# EAGLE design trezor_v1 (EAGLE 6.5.0)
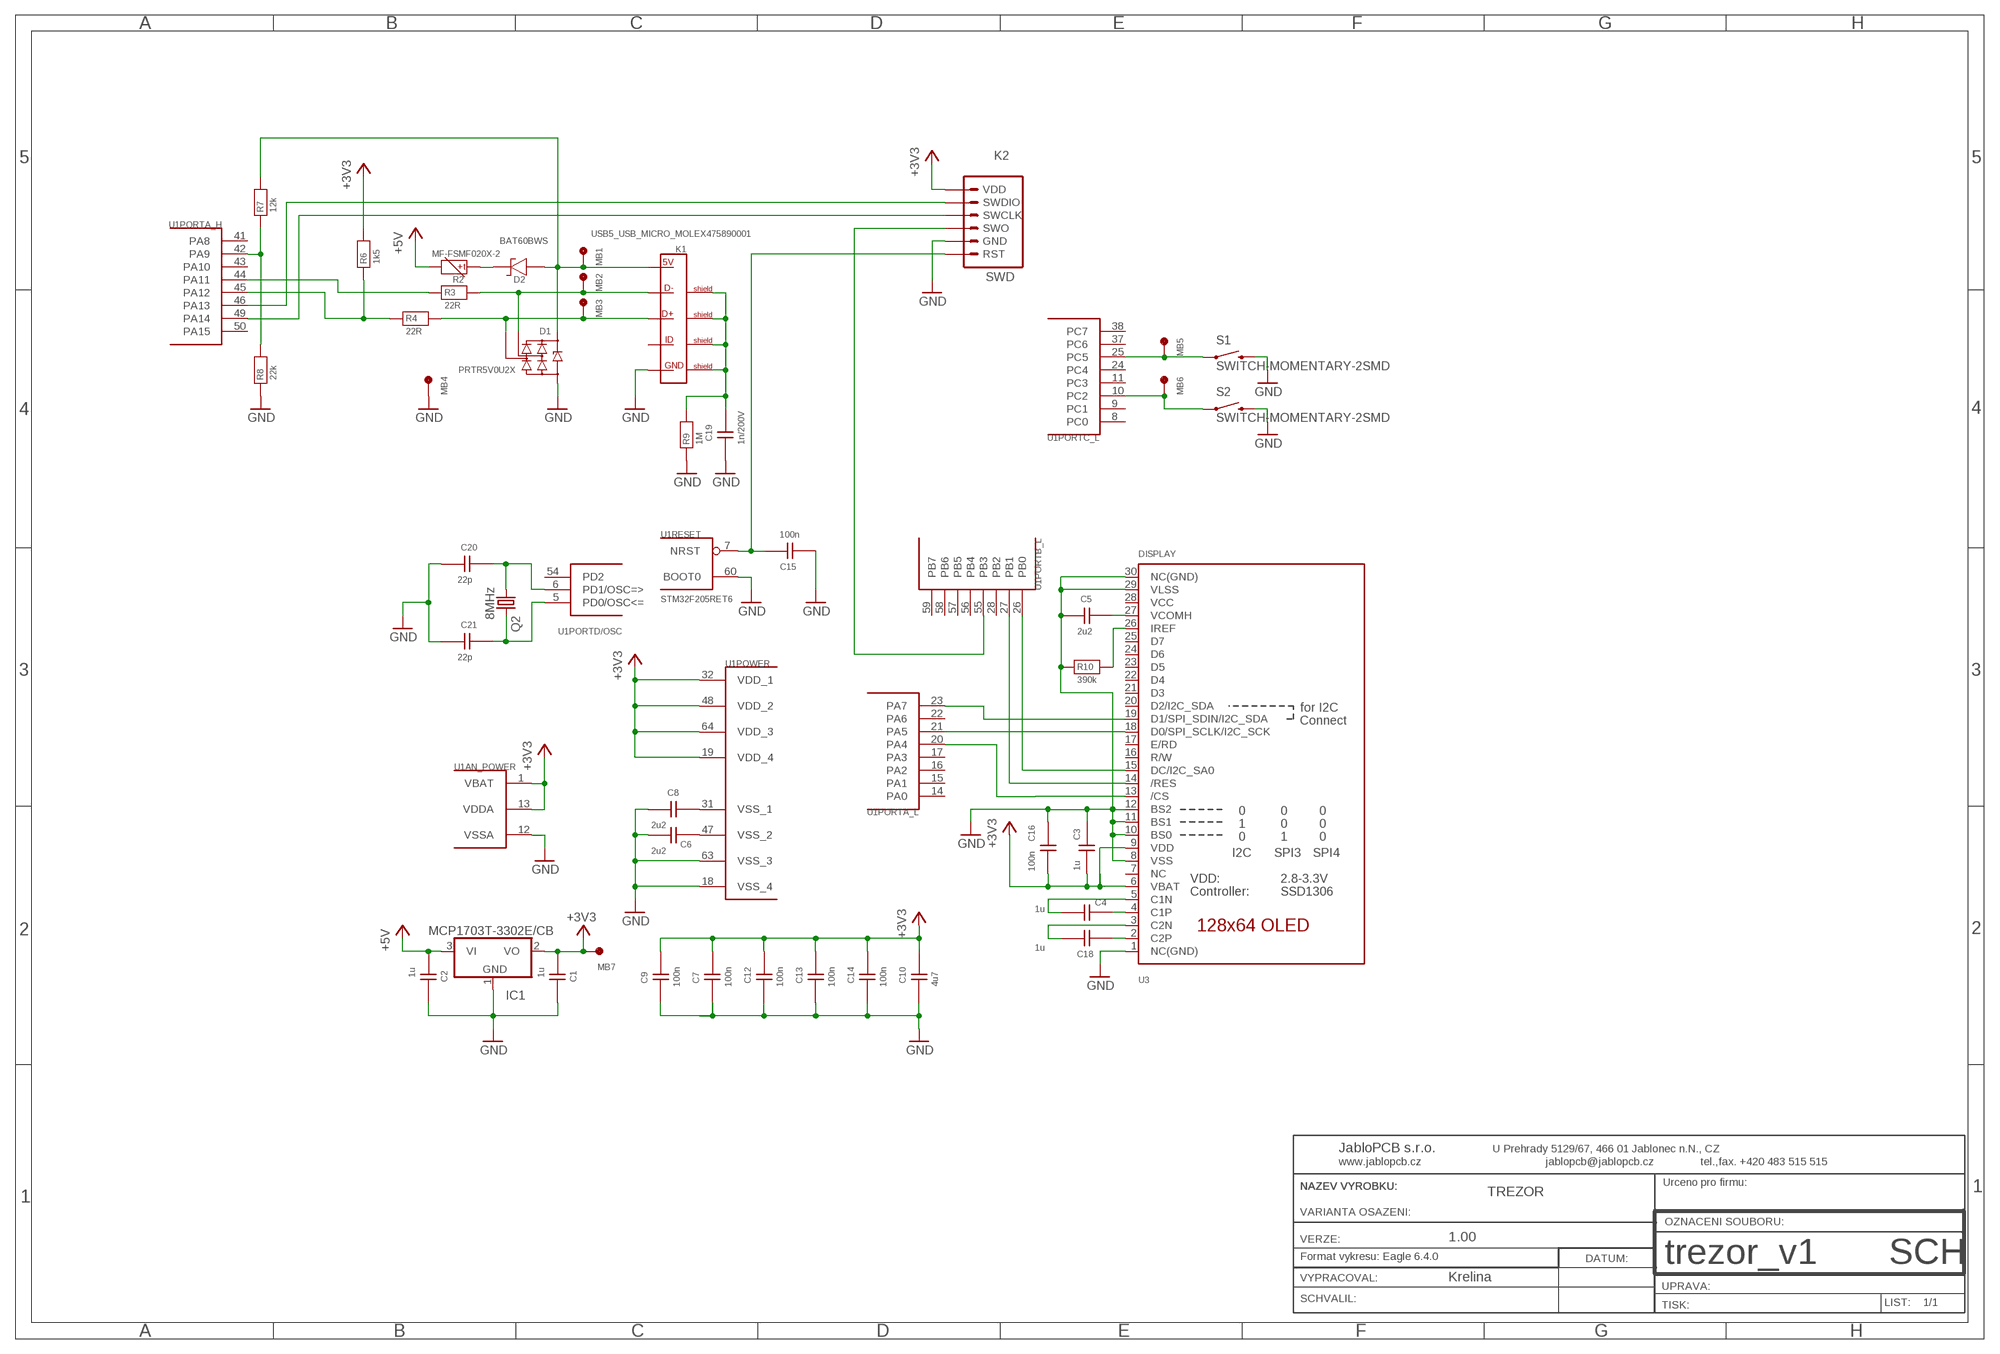
[diagram p0: schematic, sheet 1]

## Parts
C1  1u  C_0402  [0402]
C2  1u  C_0402  [0402]
C3  1u  C_0402  [0402]
C4  1u  C_0402  [0402]
C5  2u2  C_0603  [0603]
C6  2u2  C_0402  [0402]
C7  100n  C_0402  [0402]
C8  2u2  C_0402  [0402]
C9  100n  C_0402  [0402]
C10  4u7  C_0603  [0603]
C12  100n  C_0402  [0402]
C13  100n  C_0402  [0402]
C14  100n  C_0402  [0402]
C15  100n  C_0402  [0402]
C16  100n  C_0402  [0402]
C18  1u  C_0402  [0402]
C19  1n/200V  C_0603  [0603]
C20  22p  C_0402  [0402]
C21  22p  C_0402  [0402]
D1  PRTR5V0U2X  PRTR5V0_SOT143B  [SOT143B]
D2  BAT60BWS  DS_SOD323  [SOD323]
IC1  MCP1703T-3302E/CB  MCP1703CB  [SOT23]
K1  USB5_USB_MICRO_MOLEX475890001  [USB_MICRO-MOLEX475890001]
K2  SWD  [SWD]
MB1  MB_1.50  [MB1.5]
MB2  MB_1.50  [MB1.5]
MB3  MB_1.50  [MB1.5]
MB4  MB_1.50  [MB1.5]
MB5  MB_1.50  [MB1.5]
MB6  MB_1.50  [MB1.5]
MB7  MB_1.50  [MB1.5]
Q2  8MHz  CRYSTALCTS406  [CTS406]
R2  MF-FSMF020X-2  POLYSWITCH_0603  [0603]
R3  22R  R_0402  [0402]
R4  22R  R_0402  [0402]
R6  1k5  R_0402  [0402]
R7  12k  R_0402  [0402]
R8  22k  R_0402  [0402]
R9  1M  R_0603  [0603]
R10  390k  R_0402  [0402]
S1  SWITCH-MOMENTARY-2SMD  [TACTILE_SWITCH_SMD]
S2  SWITCH-MOMENTARY-2SMD  [TACTILE_SWITCH_SMD]
U1  STM32F205RET6  STM32F10XRXT6  [TQFP64]
U3  DISPLAY  DISP_OLED_UG-2864HSWEG010.96"  [UG-2864HSWEG01_0.96IN_WRAPAROUND]

## Nets
+3V3: C1.P$1 C3.P$1 C7.P$2 C9.P$2 C10.2 C12.P$2 C13.P$2 C14.P$2 C16.P$1 IC1.2(VO) K2.6(VDD) MB7.1 R6.P$2 U1.1(AN_POWER:VBAT) U1.13(AN_POWER:VDDA) U1.19(POWER:VDD_4) U1.32(POWER:VDD_1) U1.48(POWER:VDD_2) U1.64(POWER:VDD_3) U3.6(VBAT) U3.9(VDD)
+5V: C2.P$1 IC1.3(VI) R2.2
GND: C1.P$2 C2.P$2 C3.P$2 C5.1 C6.P$1 C7.P$1 C8.P$1 C9.P$1 C10.1 C12.P$1 C13.P$1 C14.P$1 C15.P$1 C16.P$2 C19.1 C20.P$1 C21.P$1 D1.1(GND) IC1.1(GND) K1.5(5_GND) K2.2(GND) MB4.1 R8.P$1 R9.1 R10.P$1 S1.3 S1.4 S2.3 S2.4 U1.12(AN_POWER:VSSA) U1.18(POWER:VSS_4) U1.60(RESET:BOOT0) U1.63(POWER:VSS_3) U3.1(NC(GND)) U3.8(VSS) U3.10(BS0) U3.11(BS1) U3.12(BS2) U3.29(VLSS) U3.30(NC(GND))
N$1: U1.23(PORTA_L:PA7) U3.19(D1/SPI_SDIN/I2C_SDA)
N$2: C15.P$2 K2.1(RST) U1.7(RESET:NRST)
N$3: U1.26(PORTB_L:PB0) U3.15(DC/I2C_SA0)
N$4: C8.P$2 U1.31(POWER:VSS_1)
N$5: U1.21(PORTA_L:PA5) U3.18(D0/SPI_SCLK/I2C_SCK)
N$6: C5.2 U3.27(VCOMH)
N$7: U1.27(PORTB_L:PB1) U3.14(/RES)
N$8: C6.P$2 U1.47(POWER:VSS_2)
N$9: R10.P$2 U3.26(IREF)
N$10: C18.P$1 U3.2(C2P)
N$11: C4.P$1 U3.4(C1P)
N$12: C18.P$2 U3.3(C2N)
N$13: C4.P$2 U3.5(C1N)
N$14: K2.3(SWO) U1.55(PORTB_L:PB3)
N$15: K2.5(SWDIO) U1.46(PORTA_H:PA13)
N$16: U1.20(PORTA_L:PA4) U3.13(/CS)
N$17: K2.4(SWCLK) U1.49(PORTA_H:PA14)
N$18: R3.P$1 U1.44(PORTA_H:PA11)
N$19: MB5.1 S1.1 S1.2 U1.25(PORTC_L:PC5)
N$20: MB6.1 S2.1 S2.2 U1.10(PORTC_L:PC2)
N$21: D1.4(VCC) D2.A K1.1(1_5V) MB1.1 R7.P$2
N$22: D2.K R2.1
N$23: D1.2(I/O1) K1.2(2_D-) MB2.1 R3.P$2
N$24: D1.3(I/O2) K1.3(3_D+) MB3.1 R4.P$2
N$26: C19.2 K1.S1_BOT(SHIELD_1) K1.S1_TOP(SHIELD_1) K1.S2_BOT(SHIELD_2) K1.S2_TOP(SHIELD_2) K1.S3_BOT(SHIELD_3) K1.S3_TOP(SHIELD_3) K1.S4_BOT(SHIELD_4) K1.S4_TOP(SHIELD_4) K1.SA(SHIELD_1) K1.SB(SHIELD_2) R9.2
N$27: R7.P$1 R8.P$2 U1.42(PORTA_H:PA9)
USB_D_P: R4.P$1 R6.P$1 U1.45(PORTA_H:PA12)
XTAL1: C20.P$2 Q2.1 U1.6(PORTD/OSC:PD1/OSC=>)
XTAL2: C21.P$2 Q2.3 U1.5(PORTD/OSC:PD0/OSC<=)
Unconnected: K1.4(4_ID) U1.2(PORTC_H:PC13) U1.3(PORTC_H:PC14) U1.4(PORTC_H:PC15) U1.8(PORTC_L:PC0) U1.9(PORTC_L:PC1) U1.11(PORTC_L:PC3) U1.14(PORTA_L:PA0) U1.15(PORTA_L:PA1) U1.16(PORTA_L:PA2) U1.17(PORTA_L:PA3) U1.22(PORTA_L:PA6) U1.24(PORTC_L:PC4) U1.28(PORTB_L:PB2) U1.29(PORTB_H:PB10) U1.30(PORTB_H:PB11) U1.33(PORTB_H:PB12) U1.34(PORTB_H:PB13) U1.35(PORTB_H:PB14) U1.36(PORTB_H:PB15) U1.37(PORTC_L:PC6) U1.38(PORTC_L:PC7) U1.39(PORTC_H:PC8) U1.40(PORTC_H:PC9) U1.41(PORTA_H:PA8) U1.43(PORTA_H:PA10) U1.50(PORTA_H:PA15) U1.51(PORTC_H:PC10) U1.52(PORTC_H:PC11) U1.53(PORTC_H:PC12) U1.54(PORTD/OSC:PD2) U1.56(PORTB_L:PB4) U1.57(PORTB_L:PB5) U1.58(PORTB_L:PB6) U1.59(PORTB_L:PB7) U1.61(PORTB_H:PB8) U1.62(PORTB_H:PB9) U3.7(NC) U3.16(R/W) U3.17(E/RD) U3.20(D2/I2C_SDA) U3.21(D3) U3.22(D4) U3.23(D5) U3.24(D6) U3.25(D7)

## Notes on the sheet
- TREZOR
- 1.00
- Krelina

## Power pins joined to a net without a drawn wire
VCC: U3.28(VCC)

## Library data of the parts
C1-C10 C12-C16 C18-C21 = vyber:C
D1 = vyber:PRTR5V0
D2 = vyber:DS
IC1 = linear:MCP1703: 250 mA, 16V, Low Quiescent Current LDO Regulator Source: http://ww1.microchip.com/downloads/en/DeviceDoc/22049b.pdf
K1 = vyber:USB5
K2 = fabhack:SWD: SWD Miniature connector for ARM programming.
MB1-MB7 = vyber:MB
Q2 = crystal:CRYSTAL: CRYSTAL
R2 = vyber:POLYSWITCH
R3 R4 R6-R10 = vyber:R
S1 S2 = SparkFun-Electromechanical:SWITCH-MOMENTARY-2: Various NO switches- pushbuttons, reed, etc
U1 = stm32:STM32F10XRXT6: STM32F101/103 64pin LQFP
U3 = microbuilder:DISP_OLED_UG-2864HSWEG01: UG-2864HSWEG01 OLED display Both 1.3" and 0.96" models share the same FPC tab footprint, only the screen dimensions vary.

## Board
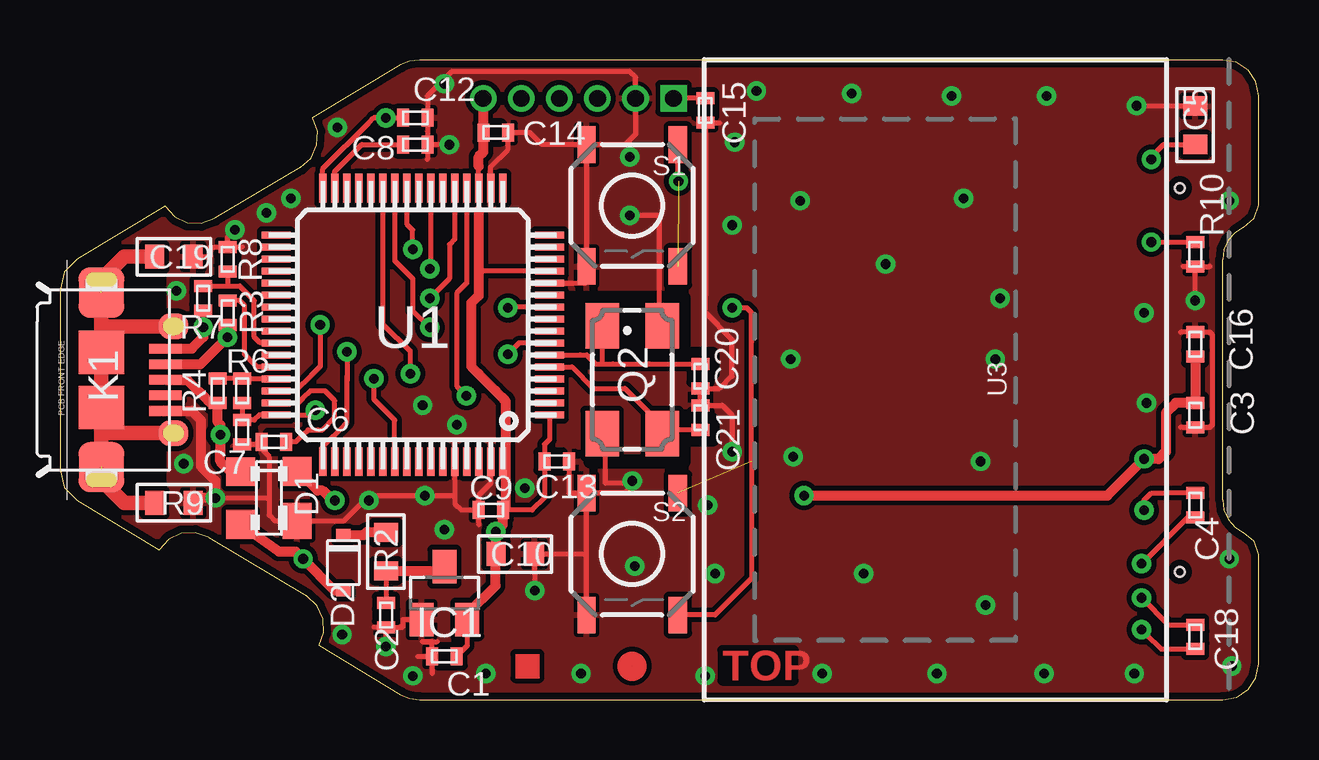
[diagram p1: board, top side]
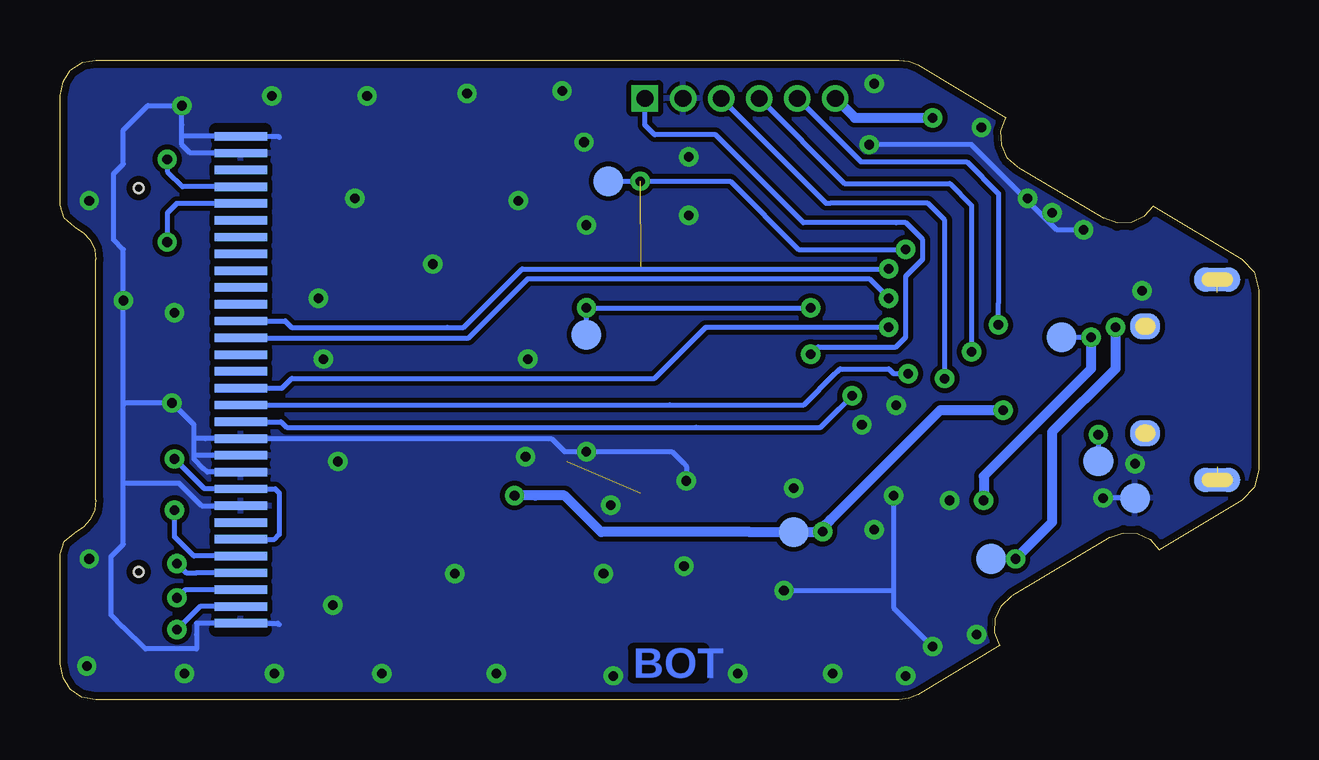
[diagram p2: board, bottom side, seen from below]

Size 49.96 x 26.67 mm. Coordinates in mm from the lower left corner, seen from the top.
Outline: 4.39,20.57 0.71,18.36 0.18,17.83 0,17.07 0,9.58 0.18,8.84 0.71,8.31 4.14,6.25 4.52,6.68 5.05,6.93 5.64,6.96 6.2,6.76 10.29,4.32 10.72,3.91 10.97,3.38 11,2.79 10.79,2.26 14.2,0.2 14.58,0.05 14.99,0 48.46,0 49.05,0.1 49.53,0.43 49.83,0.91 49.96,1.5 49.96,6.05 49.78,6.6 49.35,6.96 49,7.19 48.69,7.52 48.51,7.9 48.46,8.33 48.46,18.34 48.51,18.77 48.69,19.15 49,19.48 49.35,19.71 49.78,20.07 49.96,20.62 49.96,25.17 49.83,25.76 49.53,26.24 49.02,26.57 48.46,26.67 14.99,26.67 14.58,26.62 14.2,26.47 10.54,24.26 10.74,23.7 10.69,23.11 10.46,22.58 10.03,22.2 6.45,20.07 5.89,19.86 5.31,19.89 4.78,20.14 4.39,20.57
Copper layers (1*16): Top 0.035mm / dielectric 1.5mm / Bottom 0.035mm
Design rules "default *": minimum track width 8mil, minimum drill 0.4mm, track to track 6mil, track to pad 6mil, pad to pad 6mil, via to via 6mil, smd to smd 0mil, copper to edge 0.3mm, drill to drill 8mil, minimum pad ring 8mil, minimum via ring 8mil, stop-mask expansion 4mil, vias tented up to drill 0.4mm, thermal gap 6mil
tRestrict: 13 lines
bRestrict: 5 lines

### Footprints (pad centres in the part's own frame; a part is rotated, then mirrored left to right if it is on the bottom)
0402 = smd 0.5 x 0.75: P$1 -0.508,0; P$2 0.508,0
0603 = smd 0.8 x 1: 1 -0.8,0; 2 0.8,0
SOT143B = smd 1.5 x 1.2: 1 -0.948,-1.178 | smd 1.2 x 1.2: 2 1.103,-1.178; 3 1.098,1.178; 4 -1.098,1.178
SOD323 = smd 0.5 x 0.6: A -1.15,0; K 1.15,0
SOT23 = smd 1 x 1.4: 1 -0.95,-1.1; 2 0.95,-1.1; 3 0,1.1
USB_MICRO-MOLEX475890001 = smd 1.35 x 0.4: 1 2.675,1.3; 2 2.675,0.65; 3 2.675,0; 4 2.675,-0.65; 5 2.675,-1.3 | smd 1.9 x 1 bottom: S1_BOT 0,4.175; S2_BOT 0,-4.175 | smd 1.9 x 2.075: S1_TOP 0,3.638; S2_TOP 0,-3.638 | smd 1.25 x 1.1 bottom: S3_BOT 3,-2.225; S4_BOT 3,2.225 | smd 1.25 x 1.1: S3_TOP 3,-2.225; S4_TOP 3,2.225 | smd 1.9 x 1.8: SA 0,-1.15; SB 0,1.15
SWD = drill 0.7 square: 1 0,0 | drill 0.7: 2 1.587,0; 3 3.175,0; 4 4.763,0; 5 6.35,0; 6 7.938,0
MB1.5 = smd 1.25 x 1.25: 1 0,0
CTS406 = smd 1.9 x 1.4: 1 -2.25,-1.25; 2 2.25,-1.25; 3 2.25,1.25; 4 -2.25,1.25
TACTILE_SWITCH_SMD = smd 1.524 x 0.762: 1 -2.54,1.905; 2 2.54,1.905; 3 -2.54,-1.905; 4 2.54,-1.905
TQFP64 = smd 1.2 x 0.3: 1 -5.7,3.75; 2 -5.7,3.25; 3 -5.7,2.75; 4 -5.7,2.25; 5 -5.7,1.75; 6 -5.7,1.25; 7 -5.7,0.75; 8 -5.7,0.25; 9 -5.7,-0.25; 10 -5.7,-0.75; 11 -5.7,-1.25; 12 -5.7,-1.75; 13 -5.7,-2.25; 14 -5.7,-2.75; 15 -5.7,-3.25; 16 -5.7,-3.75; 33 5.7,-3.75; 34 5.7,-3.25; 35 5.7,-2.75; 36 5.7,-2.25; 37 5.7,-1.75; 38 5.7,-1.25; 39 5.7,-0.75; 40 5.7,-0.25; 41 5.7,0.25; 42 5.7,0.75; 43 5.7,1.25; 44 5.7,1.75; 45 5.7,2.25; 46 5.7,2.75; 47 5.7,3.25; 48 5.7,3.75 | smd 0.3 x 1.2: 17 -3.75,-5.7; 18 -3.25,-5.7; 19 -2.75,-5.7; 20 -2.25,-5.7; 21 -1.75,-5.7; 22 -1.25,-5.7; 23 -0.75,-5.7; 24 -0.25,-5.7; 25 0.25,-5.7; 26 0.75,-5.7; 27 1.25,-5.7; 28 1.75,-5.7; 29 2.25,-5.7; 30 2.75,-5.7; 31 3.25,-5.7; 32 3.75,-5.7; 49 3.75,5.7; 50 3.25,5.7; 51 2.75,5.7; 52 2.25,5.7; 53 1.75,5.7; 54 1.25,5.7; 55 0.75,5.7; 56 0.25,5.7; 57 -0.25,5.7; 58 -0.75,5.7; 59 -1.25,5.7; 60 -1.75,5.7; 61 -2.25,5.7; 62 -2.75,5.7; 63 -3.25,5.7; 64 -3.75,5.7
UG-2864HSWEG01_0.96IN_WRAPAROUND = smd 0.35 x 2.2 bottom: 1 -10.15,-1.2; 2 -9.45,-1.2; 3 -8.75,-1.2; 4 -8.05,-1.2; 5 -7.35,-1.2; 6 -6.65,-1.2; 7 -5.95,-1.2; 8 -5.25,-1.2; 9 -4.55,-1.2; 10 -3.85,-1.2; 11 -3.15,-1.2; 12 -2.45,-1.2; 13 -1.75,-1.2; 14 -1.05,-1.2; 15 -0.35,-1.2; 16 0.35,-1.2; 17 1.05,-1.2; 18 1.75,-1.2; 19 2.45,-1.2; 20 3.15,-1.2; 21 3.85,-1.2; 22 4.55,-1.2; 23 5.25,-1.2; 24 5.95,-1.2; 25 6.65,-1.2; 26 7.35,-1.2; 27 8.05,-1.2; 28 8.75,-1.2; 29 9.45,-1.2; 30 10.15,-1.2 | hole 0.4: -8,-5.45; 8,-5.45

### Placement (x,y rotation side)
C1  16.03,1.8 180 top
C2  13.59,3.53 270 top
C3  47.32,11.86 270 top
C4  47.32,8.1 90 top
C5  47.32,23.95 270 top
C6  8.92,10.74 0 top
C7  7.59,11.15 90 top
C8  14.81,23.14 180 top
C9  17.96,7.9 0 top
C10  18.97,6.07 180 top
C12  14.81,24.26 180 top
C13  20.7,9.93 180 top
C14  18.16,23.65 180 top
C15  26.9,24.56 90 top
C16  47.32,14.81 90 top
C18  47.32,2.62 90 top
C19  4.75,18.47 180 top
C20  26.7,13.49 90 top
C21  26.7,11.76 270 top
D1  8.71,8.41 90 top
D2  11.81,5.71 90 top
IC1  16.03,4.44 0 top
K1  1.73,13.34 0 top
K2  25.58,25.07 180 top
MB1  11.15,5.87 0 bottom
MB2  8.2,15.11 0 bottom
MB3  6.68,9.93 0 bottom
MB4  5.16,8.41 0 bottom
MB5  27.1,21.62 0 bottom
MB6  28.02,15.21 0 bottom
MB7  19.38,6.98 0 bottom
Q2  23.85,13.34 270 top
R2  13.59,6.17 270 top
R3  6.98,16.13 270 top
R4  6.58,12.88 270 top
R6  7.59,12.88 270 top
R7  5.97,16.74 270 top
R8  6.98,18.36 270 top
R9  4.75,8.2 180 top
R10  47.32,18.57 90 top
S1  23.85,20.6 270 top
S2  23.85,6.07 270 top
U1  14.71,15.62 180 top
U3  41.22,13.34 90 top
U$3  [BADMARK]  19.48,1.4 0 top
U$4  [CENTR]  23.85,1.4 0 top
U$5  [RAM_BRD]  -114.43,-82.63 0 top  (outside the outline)

### Tracks (layer width: path | path; a pad name or v marks a point on that pad's centre or on a via)
+3V3  (via drill 0.4)
  Top 0.203: R6.P$2 C7.P$2 8.1,11.66 8.31,11.87 U1.48 10.45,11.87 v10.64,12.06 10.5,11.92 | C9.P$2 19.68,7.9 20.19,8.41 C13.P$2 20.19,10.64 20.41,10.86 U1.1 | IC1.2 16.98,2.25 C1.P$1 | U1.32 10.96,22.13 12.88,24.05 13.08,24.26 | 13.08,24.26 v13.59,24.26 | v13.59,24.26 C12.P$2 | 17.64,23.66 C14.P$2 | v18.17,7 18.17,6.58 | v13.59,24.26 13.08,24.26 | 17.46,20.39 U1.19 17.46,22.32 17.45,22.22 | U1.13 17.47,17.87 17.46,17.86 | U1.64 18.56,9.92 18.57,9.93
  Top 0.406: IC1.2 16.98,3.57 18.16,4.75 18.16,6.06 C10.2 18.17,6.58 v18.17,7 18.47,7.29 C9.P$2 18.57,8 18.57,9.93 18.57,10.74 18.57,12.47 18.46,12.58 18.16,12.88 17.46,13.58 17.14,13.89 17.14,16.54 17.46,16.85 17.46,17.05 17.46,17.86 17.46,20.39 | K2.6 17.64,23.66 | C14.P$2 17.65,22.83 17.45,22.63 17.45,22.22 | v31.01,8.51 43.66,8.51 v45.19,10.03 45.8,10.03 46.1,10.34 46.1,11.96 46.51,12.37 C3.P$1 C16.P$1
  Bottom 0.203: U3.6 41.02,6.68 40.82,6.88 40.82,8.61 40.99,8.78 U3.9 43.94,8.78 v45.19,10.03 | MB7.1 18.16,6.98 v18.17,7 18.19,6.98
  Bottom 0.406: v10.64,12.06 13.28,12.06 17.86,7.49 18.17,7.18 v18.17,7 | K2.6 16.83,24.26 15.62,24.26 v13.59,24.26 | 18.19,6.98 21.21,6.98 27.41,6.98 28.93,8.51 30.15,8.51 v31.01,8.51
+5V
  Top 0.203: R2.2 C2.P$1
  Top 0.406: R2.2 16.03,5.37 IC1.3
GND  (via drill 0.4)
  Top 0.2: 47.22,18.06 47.93,18.06
  Top 0.203: C6.P$1 8.51,10.64 | 8.51,10.64 C7.P$1 | 8.51,10.64 8.51,10.34 8.71,10.13 8.71,8.41 | 8.71,8.41 8.71,7.7 8.95,7.46 D1.1 11.83,7.46 12.88,8.51 v15.21,8.51 16.46,8.51 | C13.P$1 21.21,8.61 S2.3 | S2.4 21.95,6.07 | 21.95,6.07 S2.3 | 21.95,6.07 C10.1 19.77,4.56 v19.79,4.55 | U1.60 16.46,8.51 | 16.46,8.51 16.46,8.18 16.74,7.9 C9.P$1 | U1.63 17.96,9.02 17.55,8.61 17.45,8.51 C9.P$1 | 14.91,1.8 C1.P$2 | C2.P$2 14.16,3.02 14.3,3.02 14.3,3.33 15.06,3.33 IC1.1 | C19.1 6.06,18.47 6.27,18.47 6.27,18.87 R8.P$1 | v6.48,8.41 8.71,8.41 | U1.12 21.95,17.37 S1.4 S1.3 | C8.P$1 C12.P$1 15.32,25.17 16.33,26.19 23.75,26.19 23.99,25.95 K2.2 23.99,23.58 23.55,23.14 S1.3 | S1.3 20.09,23.14 19.58,23.65 C14.P$1 18.67,22.94 17.96,22.22 U1.18 | v47.32,16.64 R10.P$1 47.22,18.06 46.81,18.06 | v44.88,24.76 47.31,24.76 C5.1 | v23.85,9.12 23.85,9.02 | 23.85,9.02 23.85,8.92 23.55,8.61 S2.3 | v28.02,10.34 28.02,11.86 27.61,12.27 C21.P$1 C20.P$1 27.51,12.98 28.02,13.49 28.02,15.01 26.9,16.13 26.9,16.84 26.9,16.94 C15.P$1 27.51,24.05 | R8.P$1 6.98,19.28 v7.29,19.58 | v16.23,23.14 C8.P$1 | v13.59,2.21 C2.P$2 | C8.P$1 15.32,22.53 | C9.P$1 17.45,7.29 | C2.P$2 13.08,3.02 | R8.P$1 7.59,18.87 | C1.P$2 15.52,1.09 | C1.P$2 15.52,2.41 15.11,2.41 15.72,2.41 | 46.71,11.35 C3.P$2 47.93,11.35 48.03,11.46 48.03,15.21 47.93,15.32 C16.P$2 46.71,15.32 | 23.85,9.02 22.73,9.02 22.73,11.25 | v23.75,20.19 24.97,20.19 24.97,15.62
  Top 0.406: 5.77,8.2 R9.1 5.75,8.41 v6.48,8.41 6.48,9.12 5.87,9.73 5.87,11.66 5.49,12.03 K1.5
  Bottom 0.203: 47.32,9.02 47.32,6.48 47.83,5.97 47.83,3.53 47.32,3.02 46.41,2.11 44.27,2.11 44.27,2.72 44.27,3.18 43.6,3.18 U3.1 40.88,3.18 40.82,3.12 | 47.32,9.02 47.32,12.27 | 47.32,12.27 47.32,16.54 v47.32,16.64 47.32,18.77 47.73,19.18 47.73,21.92 47.32,22.33 47.32,23.75 46.3,24.76 v44.88,24.76 44.88,23.95 | 47.32,9.02 44.98,9.02 44.05,8.08 U3.8 | 44.37,10.44 44.37,10.54 | 44.37,10.54 44.37,10.95 | 44.37,10.95 44.37,11.35 44.37,11.46 v45.29,12.37 47.32,12.37 47.32,12.27 | 44.37,10.95 44.37,10.88 43.9,10.88 U3.12 29.99,10.88 29.48,10.88 28.93,10.34 v28.02,10.34 24.46,10.34 24,9.88 23.85,9.73 v23.85,9.12 | U3.10 43.83,9.48 43.97,9.63 44.37,10.03 44.37,10.54 | U3.11 44.37,10.18 44.37,10.54 | U3.29 44.53,22.78 44.88,23.14 44.88,23.95 | 44.88,23.95 44.88,23.48 U3.30 40.86,23.48 40.82,23.44 | v7.29,19.58 8.41,19.58 11.86,23.04 11.96,23.14 v16.23,23.14 | MB4.1 v6.48,8.41 | v15.21,8.51 15.21,4.55 | 15.21,4.55 15.21,3.84 v13.59,2.21 | v19.79,4.55 15.21,4.55
  other vias: 15.11,12.27 23.75,22.63 9.63,20.9 5.16,9.83 4.85,17.04 30.45,14.2 38.99,14.2 19.38,8.81 29.03,25.37 32.99,25.27 37.16,25.17 41.12,25.17 48.74,20.8 45.19,16.13 48.74,5.87 48.84,1.4 44.78,1.09 41.02,1.09 36.55,1.09 31.78,1.09 33.5,5.26 38.38,9.93 30.56,10.13 27.3,5.26 23.95,5.56 17.75,1.09 12.88,8.31 16.54,11.46 28.02,19.79 28.12,23.24 16.03,25.68 8.61,20.29 11.76,2.72 14.71,0.99 16.03,7.09 26.9,0.99 21.72,1.09 11.56,23.85 27,8.1 30.86,20.8 37.67,20.9 34.42,18.16 39.19,16.74 38.58,3.94
  pour Top (isolate 0.203): -0.03,-0.03 50.16,-0.03 50.16,26.7 50.16,26.9 43.87,26.9 -0.03,26.9
  pour Bottom (isolate 0.203): -0.03,-0.03 50.27,-0.03 50.27,26.59 50.27,27.1 -0.03,27.1
N$1  (via drill 0.4)
  Top 0.203: U1.23 15.46,18 v15.42,17.96
  Bottom 0.203: v15.42,17.96 30.7,17.96 32.87,15.78 33.14,15.52 33.81,15.52 40.31,15.52 40.51,15.72 40.58,15.78 U3.19
N$2  (via drill 0.4)
  Top 0.203: U1.7 19.14,14.87 v18.67,14.4 | C15.P$2 K2.1
  Bottom 0.203: v18.67,14.4 18.36,14.71 15.11,14.71 14.71,15.11 14.71,17.65 14,18.36 14,19.18 14.71,19.89 15.11,19.89 18.97,19.89 22.63,23.55 25.17,23.55 25.58,23.95 K2.1
N$3  (via drill 0.4)
  Top 0.203: U1.26 13.96,19.22 13.96,18.3 14.71,17.55 14.71,16.23 v15.42,15.52
  Bottom 0.203: v15.42,15.52 15.94,15.52 23.05,15.52 25.18,13.39 40.3,13.39 40.71,12.98 U3.15
N$4
  Top 0.203: U1.31 11.46,22.02 12.57,23.14 C8.P$2
N$5  (via drill 0.4)
  Top 0.203: v15.42,16.74 16.23,17.55 16.23,18.97 16.46,19.2 U1.21
  Bottom 0.203: U3.18 32.92,15.08 30.45,17.55 16.23,17.55 v15.42,16.74
N$6  (via drill 0.4)
  Top 0.203: v45.49,22.53 45.49,22.63 46,23.14 47.31,23.14 C5.2
  Bottom 0.203: U3.27 44.85,21.38 45.49,22.02 v45.49,22.53
N$7  (via drill 0.4)
  Top 0.203: U1.27 13.46,19.11 13.46,15.65 14.6,14.5 v14.6,13.59
  Bottom 0.203: U3.14 24.55,12.28 18.96,12.28 17.65,13.59 17.45,13.79 | 17.55,13.69 17.45,13.79 | 17.45,13.79 15.42,13.79 15.21,13.59 v14.6,13.59
N$8
  Top 0.203: C6.P$2 9.83,10.74 10.13,11.05 10.34,11.25 10.74,11.25 10.95,11.25 11.46,11.76 11.46,12.47 11.05,12.88 10.64,12.88 10.44,12.88 10.13,12.57 9.98,12.42 9.93,12.37 U1.47
N$9  (via drill 0.4)
  Top 0.203: v45.49,19.08 R10.P$2
  Bottom 0.203: U3.26 43.68,20.68 45.1,20.68 45.49,20.29 45.49,19.18 v45.49,19.08
N$10  (via drill 0.4)
  Top 0.203: v45.08,2.92 45.29,2.72 45.9,2.11 C18.P$1
  Bottom 0.203: U3.2 44.12,3.88 v45.08,2.92
N$11  (via drill 0.4)
  Top 0.203: C4.P$1 47.02,7.59 v45.08,5.66
  Bottom 0.203: U3.4 44.27,5.28 44.71,5.28 v45.08,5.66
N$12  (via drill 0.4)
  Top 0.203: v45.08,4.24 46.2,3.12 C18.P$2
  Bottom 0.203: U3.3 44.74,4.58 v45.08,4.24
N$13  (via drill 0.4)
  Top 0.203: C4.P$2 46.02,8.61 45.49,8.61 45.19,8.31 v45.19,7.9
  Bottom 0.203: U3.5 44.39,5.98 45.19,6.78 v45.19,7.9
N$14  (via drill 0.4)
  Top 0.203: U1.55 13.96,11.66 13.08,12.53 v13.08,13.39
  Bottom 0.203: v13.08,13.39 13.08,15.62 13.08,19.99 13.79,20.7 17.86,20.7 18.03,20.7 K2.3
N$15  (via drill 0.4)
  Top 0.203: U1.46 9.82,12.87 9.87,12.92 10.44,13.49 10.85,13.89 v10.85,15.62
  Bottom 0.203: v10.85,15.62 10.85,16.54 10.85,16.69 10.85,21.11 12.17,22.43 16.33,22.43 16.59,22.43 K2.5
N$16  (via drill 0.4)
  Top 0.203: v16.94,12.67 16.96,12.69 16.93,12.69 16.54,13.08 16.54,16.94 16.96,17.36 U1.20
  Bottom 0.203: v16.94,12.67 17.5,12.12 | 17.5,12.12 18.03,11.58 | 17.5,12.12 18.26,11.35 23.44,11.35 40.51,11.35 40.74,11.58 U3.13
N$17  (via drill 0.4)
  Top 0.203: U1.49 10.96,10.55 11.86,11.46 11.96,11.56 11.96,12.57 11.96,13.28 | 11.96,13.28 11.96,13.49 | v11.96,14.5 11.96,14.3 11.96,13.28
  Bottom 0.203: v11.96,14.5 11.96,16.22 11.96,20.6 12.88,21.51 17.25,21.51 17.26,21.51 K2.4
N$18
  Top 0.203: R3.P$1 7.49,16.64 7.7,16.43 7.7,15.42 7.7,14.6 7.7,14.4 8.1,14 8.23,13.87 U1.44
N$19  (via drill 0.4)  (1 unrouted)
  Top 0.203: U1.25 14.46,19.83 14.71,19.58 v14.71,18.77 | v25.78,21.62 25.76,21.64 S1.1
  Bottom 0.203: v14.71,18.77 19.18,18.77 22.02,21.62 v25.78,21.62 MB5.1
N$20  (via drill 0.4)  (1 unrouted)
  Top 0.203: v28.02,16.33 28.63,16.33 28.83,16.13 28.83,14.91 28.83,9.93 28.83,5.05 27.3,3.53 S2.2 | U1.10 18.71,16.37 v18.67,16.33
  Bottom 0.203: v18.67,16.33 v28.02,16.33 MB6.1
N$21  (via drill 0.4)
  Top 0.203: R7.P$2 v5.97,15.52
  Top 0.406: K1.1 5.49,14.63 5.97,15.11 v5.97,15.52 | D1.4 9.12,6.17 9.83,6.17 v10.13,5.87 11.44,4.56 D2.A 11.64,4.56
  Bottom 0.203: MB1.1 v10.13,5.87
  Bottom 0.406: v5.97,15.52 5.97,15.11 5.97,14.5 5.97,13.79 8.61,11.15 8.61,7.39 v10.13,5.87
N$22
  Top 0.406: R2.1 12.78,6.98 12.66,6.86 D2.K
N$23  (via drill 0.4)
  Top 0.203: R3.P$2 v6.98,15.11 6.98,14.91
  Top 0.406: K1.2 5.86,13.98 v6.98,15.11 | v11.46,8.31 11.35,8.31 10.95,8.71 10.74,8.71 9.94,9.51 D1.2
  Bottom 0.203: MB2.1 v6.98,15.11
  Bottom 0.406: v6.98,15.11 6.98,13.79 11.46,9.32 v11.46,8.31
N$24  (via drill 0.4)
  Top 0.406: 6.68,10.44 v6.68,11.05 6.68,11.46 6.58,11.56 R4.P$2 6.27,12.37 6.17,12.47 5.31,13.33 K1.3 | 6.68,10.44 6.68,10.24 | D1.3 7.11,9.51 MB3.1 6.68,10.44
  Bottom 0.203: v6.68,11.05 6.68,10.34 MB3.1
N$26  (6 unrouted)
  Top 0.61: K1.S2_BOT 1.73,11.11 | 1.73,11.11 K1.SA K1.SB 1.73,15.11 | 1.73,15.11 1.73,16.43 | 1.73,16.43 K1.S1_BOT 2.68,18.47 C19.2 | 1.73,15.56 1.73,16.43 | 1.73,11.11 K1.S2_BOT | R9.2 2.68,8.2 K1.S2_BOT | K1.S3_TOP 1.73,11.11 | K1.S4_TOP 1.73,15.56 | 1.73,15.56 1.73,15.11
N$27
  Top 0.203: R7.P$1 6.98,17.25 | 6.98,17.25 7.49,17.25 7.7,17.04 8.1,16.64 8.1,15.11 8.34,14.87 U1.42 | R8.P$2 6.98,17.25
USB_D_P
  Top 0.203: R4.P$1 R6.P$1 7.61,13.37 U1.45
XTAL1
  Top 0.203: U1.6 21.69,14.37 21.95,14.37 22.33,14 23.04,14 | Q2.1 22.6,15.29 22.6,14 23.04,14 | 23.04,14 24.56,14 C20.P$2
XTAL2
  Top 0.203: U1.5 21.33,13.87 22.22,12.98 23.55,12.98 24.56,11.96 24.97,11.56 25.1,11.42 Q2.3 25.27,11.25 C21.P$2

### Text on the board
Top: TOP
Bottom: BOT
Measures: 5.92 mm | 10.06 mm | 10.77 mm | 4.80 mm | 5.33 mm | 0.00 mm | 0.20 mm | 4.42 mm | 6.48 mm | 14.22 mm | 48.49 mm | 49.99 mm | 14.61 mm | 26.64 mm | 26.70 mm | 23.14 mm | 25.20 mm | 20.65 mm | 22.23 mm | 18.39 mm | 17.86 mm | 18.36 mm | 17.09 mm | 9.60 mm | 8.36 mm | 8.86 mm | 8.33 mm | 4.34 mm | 6.07 mm | 1.52 mm | 2.29 mm | 0.00 mm | 0.00 mm | 0.00 mm | 4.17 mm | 15.01 mm | 6.22 mm | 48.54 mm | 49.81 mm | 10.31 mm | 11.02 mm | 0.74 mm | 4.55 mm | 5.08 mm | 5.66 mm
Document: 49.99x26.70 mm | TREZOR | ±0,2mm | 1,5mm / 35µm | FR4 | 1.00 | Galv. Au | frézovat | Krelina
Drill_legend: Vrtaci plan | Vytvoreno : 14.5.2014 6:51:55 | 0.7000 mm / 27.559 mil | 0.4000 mm / 15.748 mil